# EAGLE design TC board (EAGLE 6.3)
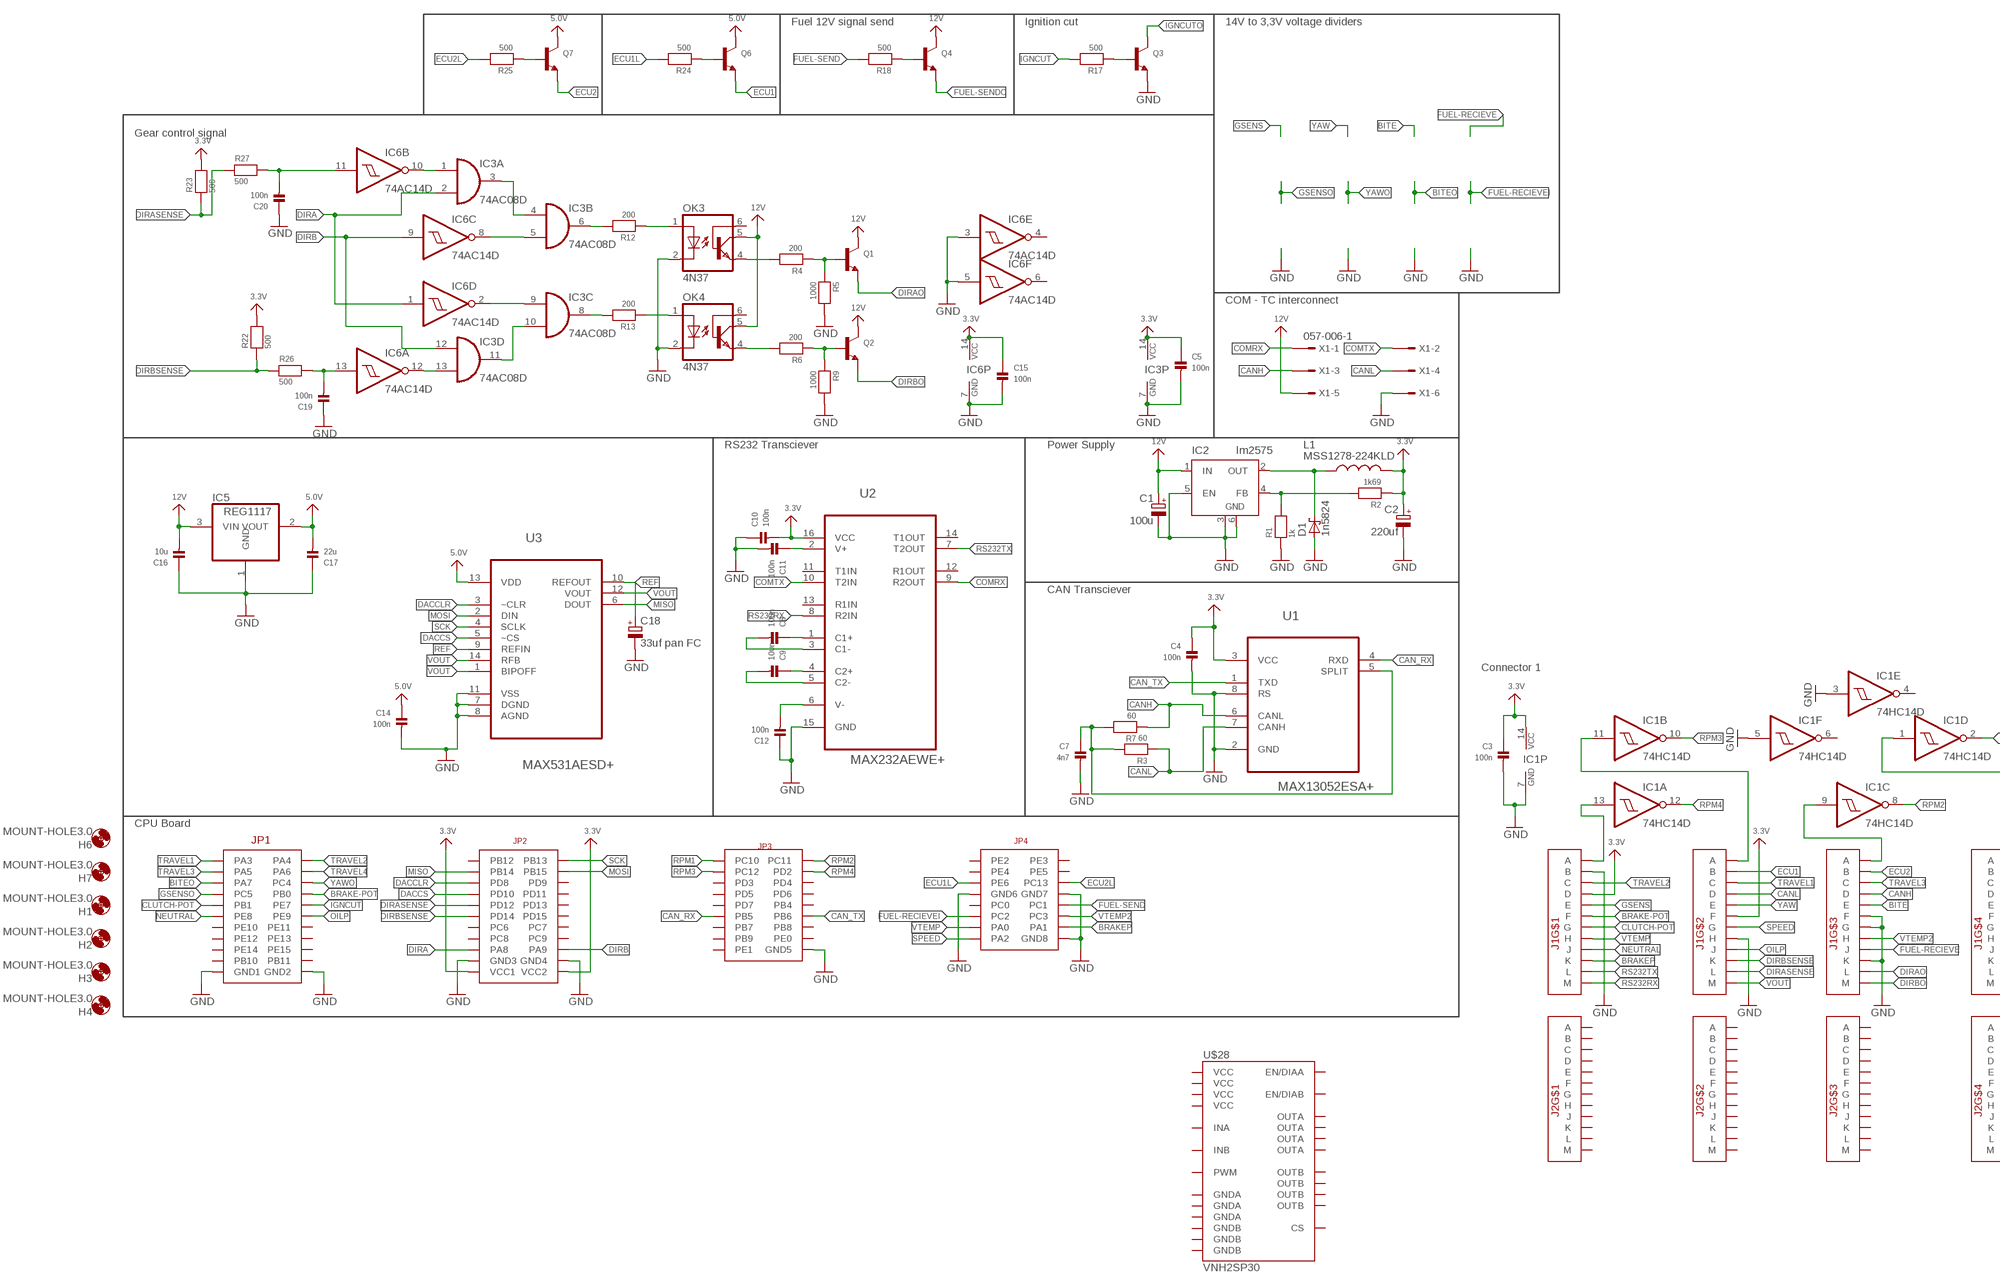
[diagram p0: schematic, sheet 1, part 1 of 2]
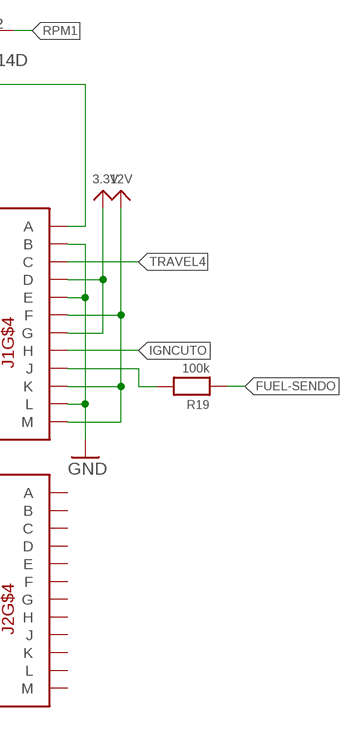
[diagram p1: schematic, sheet 1, part 2 of 2]

## Parts
C1  100u  CPOL-EUE2.5-7  [E2,5-7]
C2  220uf  CPOL-EUE3.5-8  [E3,5-8]
C3  100n  CAP_CERAMIC_0603  [_0603]
C4  100n  CAP_CERAMIC_0603  [_0603]
C5  100n  CAP_CERAMIC_0603  [_0603]
C7  4n7  CAP_CERAMIC_0603  [_0603]
C8  100n  CAP_CERAMIC_0603  [_0603]
C9  100n  CAP_CERAMIC_0603  [_0603]
C10  100n  CAP_CERAMIC_0603  [_0603]
C11  100n  CAP_CERAMIC_0603  [_0603]
C12  100n  CAP_CERAMIC_0603  [_0603]
C14  100n  CAP_CERAMIC_0603  [_0603]
C15  100n  CAP_CERAMIC_0603  [_0603]
C16  10u  CAP_CERAMIC_0805  [_0805]
C17  22u  CAP_CERAMIC_0805  [_0805]
C18  33uf pan FC  CPOL-EUUD-5X5,8  [UD-5X5,8_NICHICON]
C19  100n  CAP_CERAMIC_0805  [_0805]
C20  100n  CAP_CERAMIC_0805  [_0805]
D1  1n5824  SCHOTTKY-DIODEF126Z12  [F126Z12]
H1  MOUNT-HOLE3.0  [3,0]
H2  MOUNT-HOLE3.0  [3,0]
H3  MOUNT-HOLE3.0  [3,0]
H4  MOUNT-HOLE3.0  [3,0]
H6  MOUNT-HOLE3.0  [3,0]
H7  MOUNT-HOLE3.0  [3,0]
IC1  74HC14D  [SO14]
IC2  lm2575  LM2596S  [TO263-5]
IC3  74AC08D  [SO14]
IC5  REG1117  [SOT223]
IC6  74AC14D  [SO14]
J1  CON1  AUTOCONNECTOR  [AUTOCONNECTOR]
J2  CON1  AUTOCONNECTOR  [AUTOCONNECTOR]
L1  MSS1278-224KLD  INDUCTORPWR  [CDRH125]
OK3  4N37  [DIL06]
OK4  4N37  [DIL06]
Q1  TRANSISTOR_NPNWIDE  [SOT23-WIDE]
Q2  TRANSISTOR_NPNWIDE  [SOT23-WIDE]
Q3  TRANSISTOR_NPNWIDE  [SOT23-WIDE]
Q4  TRANSISTOR_NPNWIDE  [SOT23-WIDE]
Q6  TRANSISTOR_NPNWIDE  [SOT23-WIDE]
Q7  TRANSISTOR_NPNWIDE  [SOT23-WIDE]
R1  1k  RESISTOR_0603  [_0603]
R2  1k69  RESISTOR_0603  [_0603]
R3  60  RESISTOR_0603  [_0603]
R4  200  RESISTOR_0603  [_0603]
R5  1000  RESISTOR_0603  [_0603]
R6  200  RESISTOR_0603  [_0603]
R7  60  RESISTOR_0603  [_0603]
R9  1000  RESISTOR_0603  [_0603]
R12  200  RESISTOR_0603  [_0603]
R13  200  RESISTOR_0603  [_0603]
R17  500  RESISTOR_0603  [_0603]
R18  500  RESISTOR_0603  [_0603]
R19  100k  RESISTOR_0603  [_0603]
R22  500  RESISTOR_0603  [_0603]
R23  500  RESISTOR_0603  [_0603]
R24  500  RESISTOR_0603  [_0603]
R25  500  RESISTOR_0603  [_0603]
R26  500  RESISTOR_0603  [_0603]
R27  500  RESISTOR_0603  [_0603]
U1  MAX13052ESA+  [SOIC127P600X175-8N]
U2  MAX232AEWE+  [SOIC127P1032X265-16N]
U3  MAX531AESD+  [SOIC127P600X175-14N]
U$1  CPU-BOARD  [CPU-BOARD-JP1]
U$28  VNH2SP30  [VNH2SP30]
X1  057-006-1  [057-006-1]

## Nets
3.3V: C2.+ C3.1 C4.1 C5.1 C10.2 C15.1 IC1.14(P:VCC) IC3.14(P:VCC) IC6.14(P:VCC) J1.D1(D) J1.D4(D) J1.F2(F) J1.G4(G) L1.2 R2.1 R22.2 R23.2 U1.3(VCC) U2.16(VCC) U$1.P$43(VCC1) U$1.P$44(VCC2)
5.0V: C14.1 C17.2 IC5.2(VOUT) Q6.3(C) Q7.3(C) U3.13(VDD)
12V: C1.+ C16.2 IC2.1(IN) IC5.3(VIN) J1.F4(F) J1.K4(K) J1.M4(M) OK3.5(COL) OK4.5(COL) Q1.3(C) Q2.3(C) Q4.3(C) X1.5
BITE: J1.E3(E)
BITEO: U$1.P$5(PA7)
BRAKE-POT: J1.F1(F) U$1.P$8(PB0)
BRAKEP: J1.K1(K) U$1.P$76(PA1)
CAN_RX: U1.4(RXD) U$1.P$55(PB5)
CAN_TX: U1.1(TXD) U$1.P$56(PB6)
CANH: J1.D3(D) R7.1 U1.6(CANL) X1.3
CANL: J1.D2(D) R3.1 U1.7(CANH) X1.4
CLUTCH-POT: J1.G1(G) U$1.P$9(PB1)
COMRX: U2.9(R2OUT) X1.1
COMTX: U2.10(T2IN) X1.2
DACCLR: U3.3(~CLR) U$1.P$27(PD8)
DACCS: U3.5(~CS) U$1.P$29(PD10)
DIRA: IC3.2(A:I1) IC6.1(D:I) U$1.P$39(PA8)
DIRAO: J1.L3(L) Q1.2(E)
DIRASENSE: J1.L2(L) R23.1 R27.1 U$1.P$31(PD12)
DIRB: IC3.12(D:I0) IC6.9(C:I) U$1.P$40(PA9)
DIRBO: J1.M3(M) Q2.2(E)
DIRBSENSE: J1.K2(K) R22.1 R26.1 U$1.P$33(PD14)
ECU1: J1.B2(B) Q6.2(E)
ECU1L: R24.2 U$1.P$67(PE6)
ECU2: J1.B3(B) Q7.2(E)
ECU2L: R25.2 U$1.P$68(PC13)
FUEL-RECIEVE: J1.J3(J)
FUEL-RECIEVEI: U$1.P$73(PC2)
FUEL-SEND: R18.2 U$1.P$72(PC1)
FUEL-SENDO: Q4.2(E) R19.1
GND: C1.- C2.- C3.2 C4.2 C5.2 C7.2 C10.1 C11.2 C12.1 C14.2 C15.2 C16.1 C17.1 C18.- C19.1 C20.1 D1.A IC1.3(E:I) IC1.5(F:I) IC1.7(P:GND) IC2.3(GND) IC2.5(EN) IC2.6(GND) IC3.7(P:GND) IC5.1(GND) IC6.3(E:I) IC6.5(F:I) IC6.7(P:GND) J1.B1(B) J1.B4(B) J1.E4(E) J1.F3(F) J1.G3(G) J1.H2(H) J1.K3(K) J1.L4(L) OK3.2(C) OK4.2(C) Q3.2(E) R1.1 R5.2 R9.2 U1.2(GND) U1.8(RS) U2.15(GND) U3.7(DGND) U3.8(AGND) U3.11(VSS) U$1.P$19(GND1) U$1.P$20(GND2) U$1.P$41(GND3) U$1.P$42(GND4) U$1.P$62(GND5) U$1.P$69(GND6) U$1.P$70(GND7) U$1.P$78(GND8) X1.6
GSENS: J1.E1(E)
GSENSO: U$1.P$7(PC5)
IGNCUT: R17.2 U$1.P$10(PE7)
IGNCUTO: J1.H4(H) Q3.3(C)
MISO: U3.6(DOUT) U$1.P$25(PB14)
MOSI: U3.2(DIN) U$1.P$26(PB15)
N$1: IC2.4(FB) R1.2 R2.2
N$2: D1.C IC2.2(OUT) L1.1
N$3: IC1.9(C:I) J1.A3(A)
N$4: IC1.13(A:I) J1.A1(A)
N$5: IC1.1(D:I) J1.A4(A)
N$6: IC1.11(B:I) J1.A2(A)
N$7: OK3.4(EMI) R4.2
N$8: Q1.1(B) R4.1 R5.1
N$9: OK4.4(EMI) R6.2
N$10: Q2.1(B) R6.1 R9.1
N$11: IC3.8(C:O) R13.2
N$12: C7.1 R3.2 R7.2 U1.5(SPLIT)
N$13: C12.2 U2.6(V-)
N$14: C9.1 U2.4(C2+)
N$15: IC3.9(C:I0) IC6.2(D:O)
N$16: IC3.5(B:I1) IC6.8(C:O)
N$17: OK4.1(A) R13.1
N$18: OK3.1(A) R12.1
N$19: IC3.6(B:O) R12.2
N$20: C9.2 U2.5(C2-)
N$21: C8.2 U2.3(C1-)
N$22: C8.1 U2.1(C1+)
N$23: C11.1 U2.2(V+)
N$24: Q3.1(B) R17.1
N$25: J1.J4(J) R19.2
N$26: Q4.1(B) R18.1
N$29: IC3.3(A:O) IC3.4(B:I0)
N$30: IC3.10(C:I1) IC3.11(D:O)
N$31: IC3.13(D:I1) IC6.12(A:O)
N$32: IC3.1(A:I0) IC6.10(B:O)
N$33: C20.2 IC6.11(B:I) R27.2
N$34: Q6.1(B) R24.1
N$35: Q7.1(B) R25.1
N$36: C19.2 IC6.13(A:I) R26.2
NEUTRAL: J1.J1(J) U$1.P$11(PE8)
OILP: J1.J2(J) U$1.P$12(PE9)
REF: C18.+ U3.9(REFIN) U3.10(REFOUT)
RPM1: IC1.2(D:O) U$1.P$45(PC10)
RPM2: IC1.8(C:O) U$1.P$46(PC11)
RPM3: IC1.10(B:O) U$1.P$47(PC12)
RPM4: IC1.12(A:O) U$1.P$48(PD2)
RS232RX: J1.M1(M) U2.8(R2IN)
RS232TX: J1.L1(L) U2.7(T2OUT)
SCK: U3.4(SCLK) U$1.P$24(PB13)
SPEED: J1.G2(G) U$1.P$77(PA2)
TRAVEL1: J1.C2(C) U$1.P$1(PA3)
TRAVEL2: J1.C1(C) U$1.P$2(PA4)
TRAVEL3: J1.C3(C) U$1.P$3(PA5)
TRAVEL4: J1.C4(C) U$1.P$4(PA6)
VOUT: J1.M2(M) U3.1(BIPOFF) U3.12(VOUT) U3.14(RFB)
VTEMP: J1.H1(H) U$1.P$75(PA0)
VTEMP2: J1.H3(H) U$1.P$74(PC3)
YAW: J1.E2(E)
YAWO: U$1.P$6(PC4)
Unconnected: IC1.4(E:O) IC1.6(F:O) IC6.4(E:O) IC6.6(F:O) J2.A1(A) J2.A2(A) J2.A3(A) J2.A4(A) J2.B1(B) J2.B2(B) J2.B3(B) J2.B4(B) J2.C1(C) J2.C2(C) J2.C3(C) J2.C4(C) J2.D1(D) J2.D2(D) J2.D3(D) J2.D4(D) J2.E1(E) J2.E2(E) J2.E3(E) J2.E4(E) J2.F1(F) J2.F2(F) J2.F3(F) J2.F4(F) J2.G1(G) J2.G2(G) J2.G3(G) J2.G4(G) J2.H1(H) J2.H2(H) J2.H3(H) J2.H4(H) J2.J1(J) J2.J2(J) J2.J3(J) J2.J4(J) J2.K1(K) J2.K2(K) J2.K3(K) J2.K4(K) J2.L1(L) J2.L2(L) J2.L3(L) J2.L4(L) J2.M1(M) J2.M2(M) J2.M3(M) J2.M4(M) OK3.6(BAS) OK4.6(BAS) U2.11(T1IN) U2.12(R1OUT) U2.13(R1IN) U2.14(T1OUT) U$1.P$13(PE10) U$1.P$14(PE11) U$1.P$15(PE12) U$1.P$16(PE13) U$1.P$17(PE14) U$1.P$18(PE15) U$1.P$21(PB10) U$1.P$22(PB11) U$1.P$23(PB12) U$1.P$28(PD9) U$1.P$30(PD11) U$1.P$32(PD13) U$1.P$34(PD15) U$1.P$35(PC6) U$1.P$36(PC7) U$1.P$37(PC8) U$1.P$38(PC9) U$1.P$49(PD3) U$1.P$50(PD4) U$1.P$51(PD5) U$1.P$52(PD6) U$1.P$53(PD7) U$1.P$54(PB4) U$1.P$57(PB7) U$1.P$58(PB8) U$1.P$59(PB9) U$1.P$60(PE0) U$1.P$61(PE1) U$1.P$63(PE2) U$1.P$64(PE3) U$1.P$65(PE4) U$1.P$66(PE5) U$1.P$71(PC0) U$28.1(OUTA) U$28.3(VCC) U$28.5(INA) U$28.6(EN/DIAA) U$28.8(PWM) U$28.9(CS) U$28.10(EN/DIAB) U$28.11(INB) U$28.13(VCC) U$28.15(OUTB) U$28.16(OUTB) U$28.18(GNDB) U$28.19(GNDB) U$28.20(GNDB) U$28.21(OUTB) U$28.23(VCC) U$28.25(OUTA) U$28.26(GNDA) U$28.27(GNDA) U$28.28(GNDA) U$28.30(OUTA) U$28.SLUG1(VCC) U$28.SLUG2(OUTB) U$28.SLUG3(OUTA)

## Notes on the sheet
- Fuel 12V signal send | Ignition cut | 14V to 3,3V voltage dividers
- Gear control signal
- COM - TC interconnect
- RS232 Transciever | Power Supply
- CAN Transciever
- Connector 1
- CPU Board

## Library data of the parts
C1 C2 C18 = rcl:CPOL-EU: POLARIZED CAPACITOR, European symbol
C3-C5 C7-C12 C14-C17 C19 C20 = microbuilder:CAP_CERAMIC: Ceramic Capacitors 0402 - 0402 Surface Mount Capacitors 16pF 50V 5% [Digikey: 445-4899-2-ND] 18pF 50V 5% [Digikey: 490-1281-2-ND] 22pF 50V 5% [Digikey: 490-1283-2-ND] 68pF 50V 5% [Digikey: 490-1289-2-ND] 0.1uF 10V 10% [Digikey: 490-1318-2-ND] 1.0uF 6.3V 10% [Digikey: 490-1320-2-ND] 0603 - 0603 Surface Mount Capacitors 16 pF 50V 5% [Digikey: 445-5051-2-ND] 22 pF 50V [Digikey: PCC220ACVTR-ND] 33 pF 50V 5% [Digikey: 490-1415-1-ND] 56pF 50V 5% [Digikey: 490-1421-1-ND] 220pF 50V 5% [Digikey: 445-1285-1-ND] 680 pF 50V 2200 pF 50V 5% C0G [Digikey: 445-1297-1-ND] 5600 pF 100V 5% X7R [Digikey: 478-3711-1-ND] 0.1 µF 25V 10% [Digikey: PCC2277TR-ND] 0.22 µF 16V 10% X7R [Digikey: 445-1318-1-ND] 1.0 µF 25V 10% [Digikey: 445-5146-2-ND] 0603 - RF Specific 3pF 250V +/-0.1pF RF [Digikey: 712-1347-1-ND] 18 pF 250V 5% [Digikey: 478-3505-1-ND or 712-1322-1-ND] 56 pF 250V 5% C0G RF [Digikey: 490-4867-1-ND] 68 pF 250V RF [Digikey: 490-4868-1-ND] 0805 - 0805 Surface Mount Capacitors 220 pF 250V 2% RF Ceramic Capacitor [Digikey: 712-1398-1-ND] 1000 pF 50V 2% NP0 Ceramic Capacitor [Digikey: 478-3760-1-ND] 0.1 µF 25V 10% Ceramic Capacitor [Digikey: PCC1828TR-ND] 1.0 µF 16V 10% Ceramic Capacitor[Digikey: 490-1691-2-ND] 10.0 µF 10V 10% Ceramic Capacitor[Digikey: 709-1228-1-ND] 10.0 uF 16V 10% Ceramic Capacitor [Digikey: 478-5165-2-ND] 47 uF 6.3V 20% Ceramic Capacitor [Digikey: 587-1779-1-ND or 399-5506-1-ND] 1206 - 1206 Surface Mount Capacitors 47uF 10V 20% Ceramic Capacitor [Digikey: 490-5528-1-ND or 399-5508-1-ND or 445-6010-1-ND] 100uF 6.3V -20%, +80% Y5V Ceramic Capacitor (Digikey: 490-4512-1-ND, Mouser: 81-GRM31CF50J107ZE1L)
D1 = diode:SCHOTTKY-DIODE: Schottky Diode
H1-H4 H6 H7 = holes:MOUNT-HOLE: MOUNTING HOLE with drill center marker
IC1 IC6 = 74xx-eu:74*14: Hex schmitt trigger INVERTER
IC2 = linear:LM2596S: STEP-DOWN VOLTAGE REGULATOR
IC3 = 74xx-eu:74*08: Quad 2-input AND gate
IC5 = burr-brown:REG1117: 800mA and 1A Low Dropout (LDO) Positive Regulator 1.8V, 2.5V, 2.85V, 3.3V, 5V, and Adj; MPN: REG1117; OC_FARNELL: 1097566; OC_NEWARK: 14P6981
J1 J2 = unicorn_v2:AUTOCONNECTOR
L1 = SparkFun-Passives:INDUCTOR: Inductors Basic Inductor/Choke - 0603 and 1206. Footprints are not proven and vary greatly between part numbers. INDUCTOR POWER 3.3UH 4.0A SMD 0.197" L x 0.197" W x 0.177" H (5.00mm x 5.00mm x 4.50mm)
OK3 OK4 = optocoupler:4N37: OPTO COUPLER Source: http://www.fairchildsemi.com/pf/4N/4N35-M.html; MF: FAIRCHILD SEMICONDUCTOR; MPN: 4N37; OC_FARNELL: 1612456; OC_NEWARK: 72K9948
Q1-Q4 Q6 Q7 = microbuilder:TRANSISTOR_NPN: NPN Transistor Transistor (NPN) 500mA 45V - BC817 [Digikey: 568-1631-1-ND] Transistor (NPN) 500mA 45V - BC817,215 [Mouser: 771-BC817-T/R] SOT23-R - SOT23 footprint optimised for use with solder paste and reflow ovens. SOT23-W - SOT23 footprint optimised for hand-soldering (larger pads).
R1-R7 R9 R12 R13 R17-R19 R22-R27 = microbuilder:RESISTOR: Resistors 0402 - 0402 Surface Mount Package 22 Ohm 1% 1/16W [Digikey: 311-22.0LRTR-ND] 33 Ohm 5% 1/16W 1.0K 5% 1/16W 1.5K 5% 1/16W 2.0K 1% 1/16W 10.0K 1% 1/16W [Digikey: 311-10.0KLRTR-ND] 10.0K 5% 1/16W [Digikey: RMCF0402JT10K0TR-ND] 12.1K 1% 1/16W [Digikey: 311-22.0LRTR-ND] 100.0K 5% 1/16W 0603 - 0603 Surface Mount Package 0 Ohm 1/10 Watt 1% Resistor 15 Ohm 1/10 Watt 1% Resistor 33 Ohm 1/10 Watt 1% Resistor 49.9 Ohm 1/10 Watt 1% Resistor 100 Ohm 1/10 Watt 1% Resistor 150 Ohm 1/10 Watt 1% Resistor 240 Ohm 1/10 Watt 1% Resistor 390 Ohm 1/10 Watt 1% Resistor 560 Ohm 1/10 Watt 1% Resistor 680 Ohm 1/10 Watt 1% Resistor 750 Ohm 1/10 Watt 1% Resistor 1.0K Ohm 1/10 Watt 1% Resistor 1.5K Ohm 1/10 Watt 1% Resistor 2.0K Ohm 1/10 Watt 1% Resistor 2.2K Ohm 1/10 Watt 1% Resistor 3.3K Ohm 1/10 Watt 1% Resistor 4.7K Ohm 1/10 Watt 1% Resistor 10.0K Ohm 1/10 Watt 1% Resistor 12.0K Ohm 1/10 Watt 1% Resistor 12.1K Ohm 1/10 Watt 1% Resistor 20.0K Ohm 1/10 Watt 1% Resistor 33.0K Ohm 1/10 Watt 1% Resistor 100.0K Ohm 1/10 Watt 1% Resistor 0805 - 0805 Surface Mount Package 0 Ohm 1/8 Watt 1% Resistor 33 Ohm 1/8 Watt 1% Resistor 100 Ohm 1/8 Watt 1% Resistor 150 Ohm 1/8 Watt 1% Resistor 200 Ohm 1/8 Watt 1% Resistor 240 Ohm 1/8 Watt 1% Resistor 330 Ohm 1/8 Watt 1% Resistor 390 Ohm 1/8 Watt 1% Resistor 470 Ohm 1/8 Watt 1% Resistor 1.0K Ohm 1/8 Watt 1% Resistor 1.5K Ohm 1/8 Watt 1% Resistor 2.0K Ohm 1/8 Watt 1% Resistor 4.7K Ohm 1/8 Watt 1% Resistor 5.1K Ohm 1/8 Watt 1% Resistor 5.6K Ohm 1/8 Watt 1% Resistor 10.0K Ohm 1/8 Watt 1% Resistor 22.0K Ohm 1/8 Watt 1% Resistor 33.0K Ohm 1/8 Watt 1% Resistor 100K Ohm 1/8 Watt 1% Resistor 1206 - 1206 Surface Mount Package 2012 - 2010 Surface Mount Package 0.11 Ohm 1/2 Watt 1% Resistor - Digikey: RHM.11UCT-ND
U1 = Maxim_By_element14_Batch_1:MAX13052ESA+: Industry-Standard High-Speed CAN Transceivers with ±80V Fault Protection; MPN: MAX13052ESA+; OC_FARNELL: 1600112; OC_NEWARK: 99K2875; PACKAGE: SOIC-8; SUPPLIER: Maxim
U2 = Maxim_By_element14_Batch_1:MAX232AEWE+: +5V-Powered, Multichannel RS-232 Drivers/Receivers; MPN: MAX232AEWE+; OC_FARNELL: 9724400; OC_NEWARK: 67K4435; PACKAGE: SOIC-16; SUPPLIER: Maxim
U3 = Maxim_By_element14_Batch_1:MAX531AESD+: DAC; MPN: MAX531AESD+; OC_FARNELL: -; OC_NEWARK: 23K6158; PACKAGE: SOIC-14; SUPPLIER: Maxim
U$1 = unicorn_v2:CPU-BOARD
U$28 = SparkFun-PowerIC:VNH2SP30: 30A motor driver IC
X1 = con-panduit:057-006-: CONNECTOR 6-pin series 057 contact pc board low profile headers; OC_FARNELL: unknown; OC_NEWARK: unknown

## Board
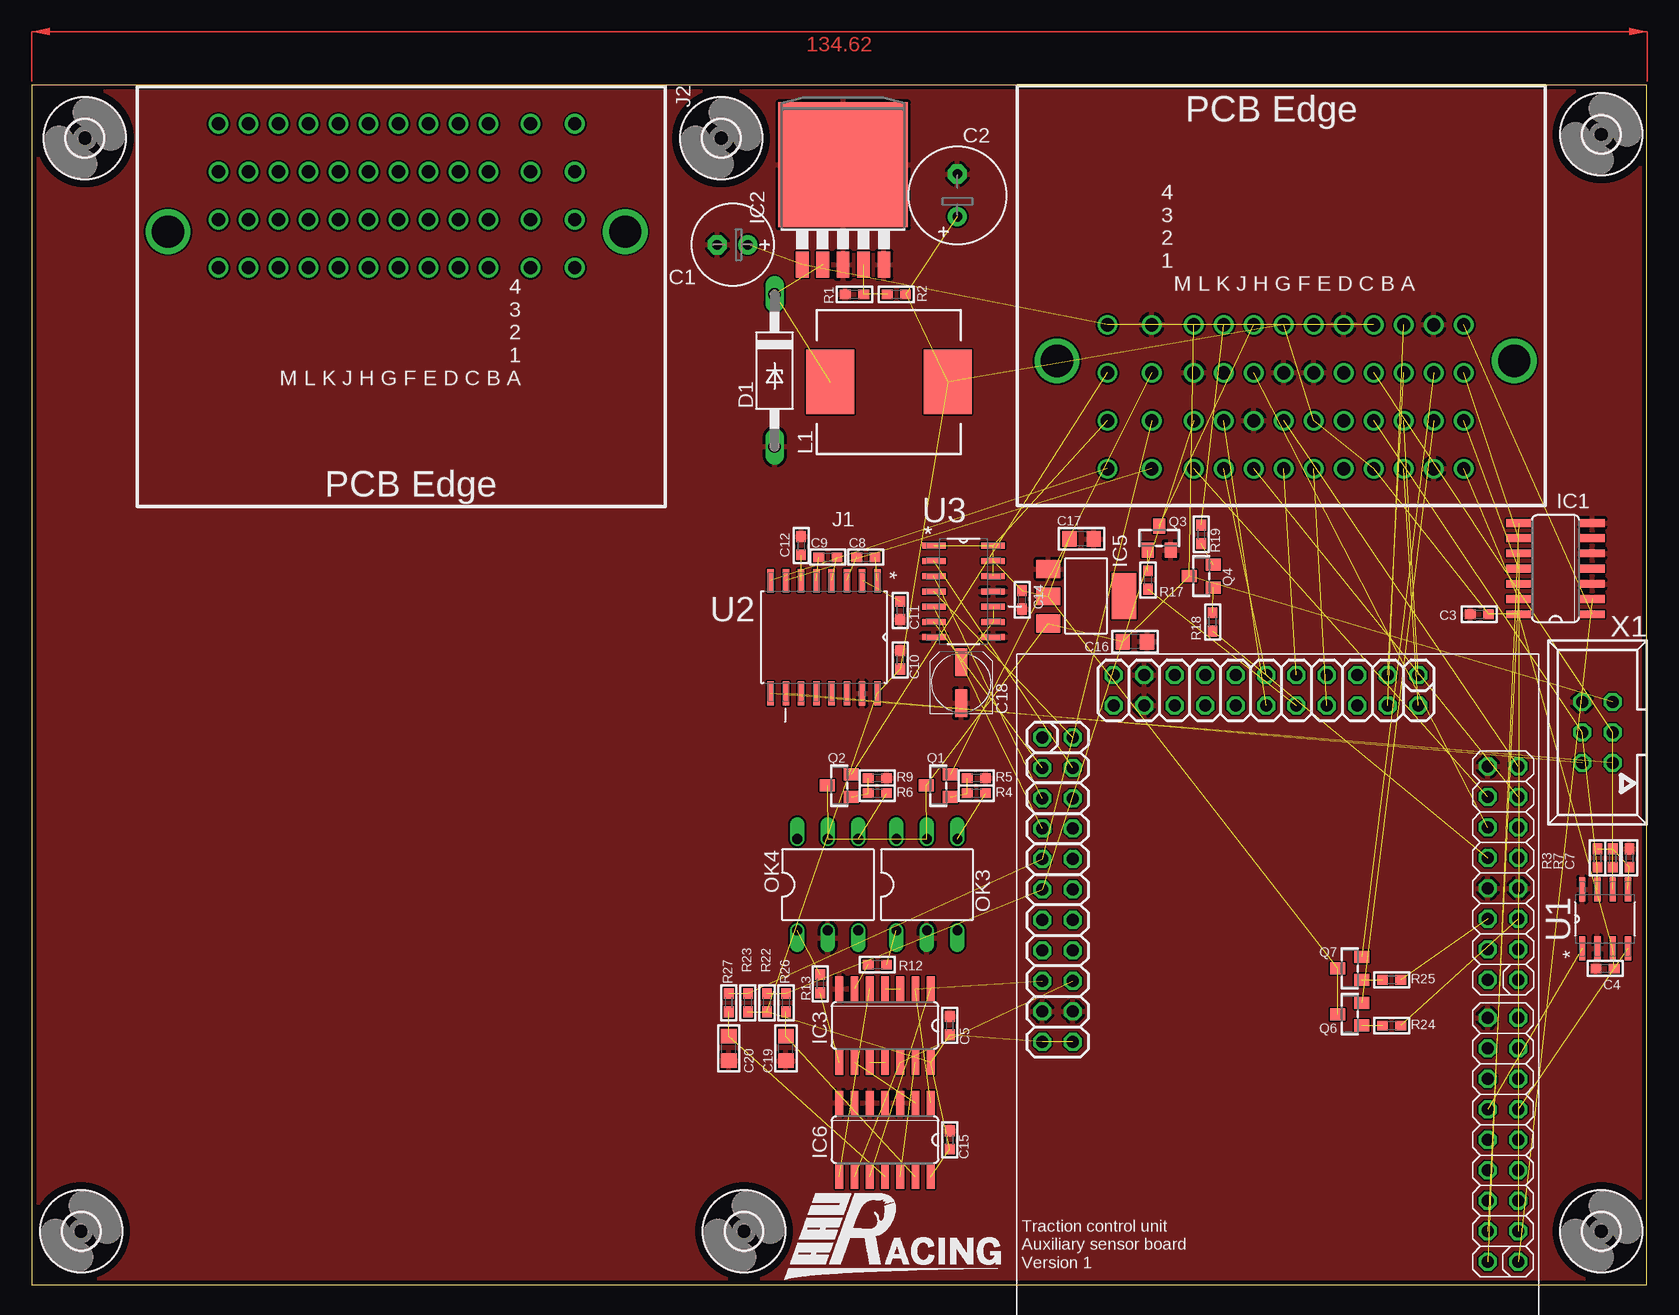
[diagram p2: board, top side]
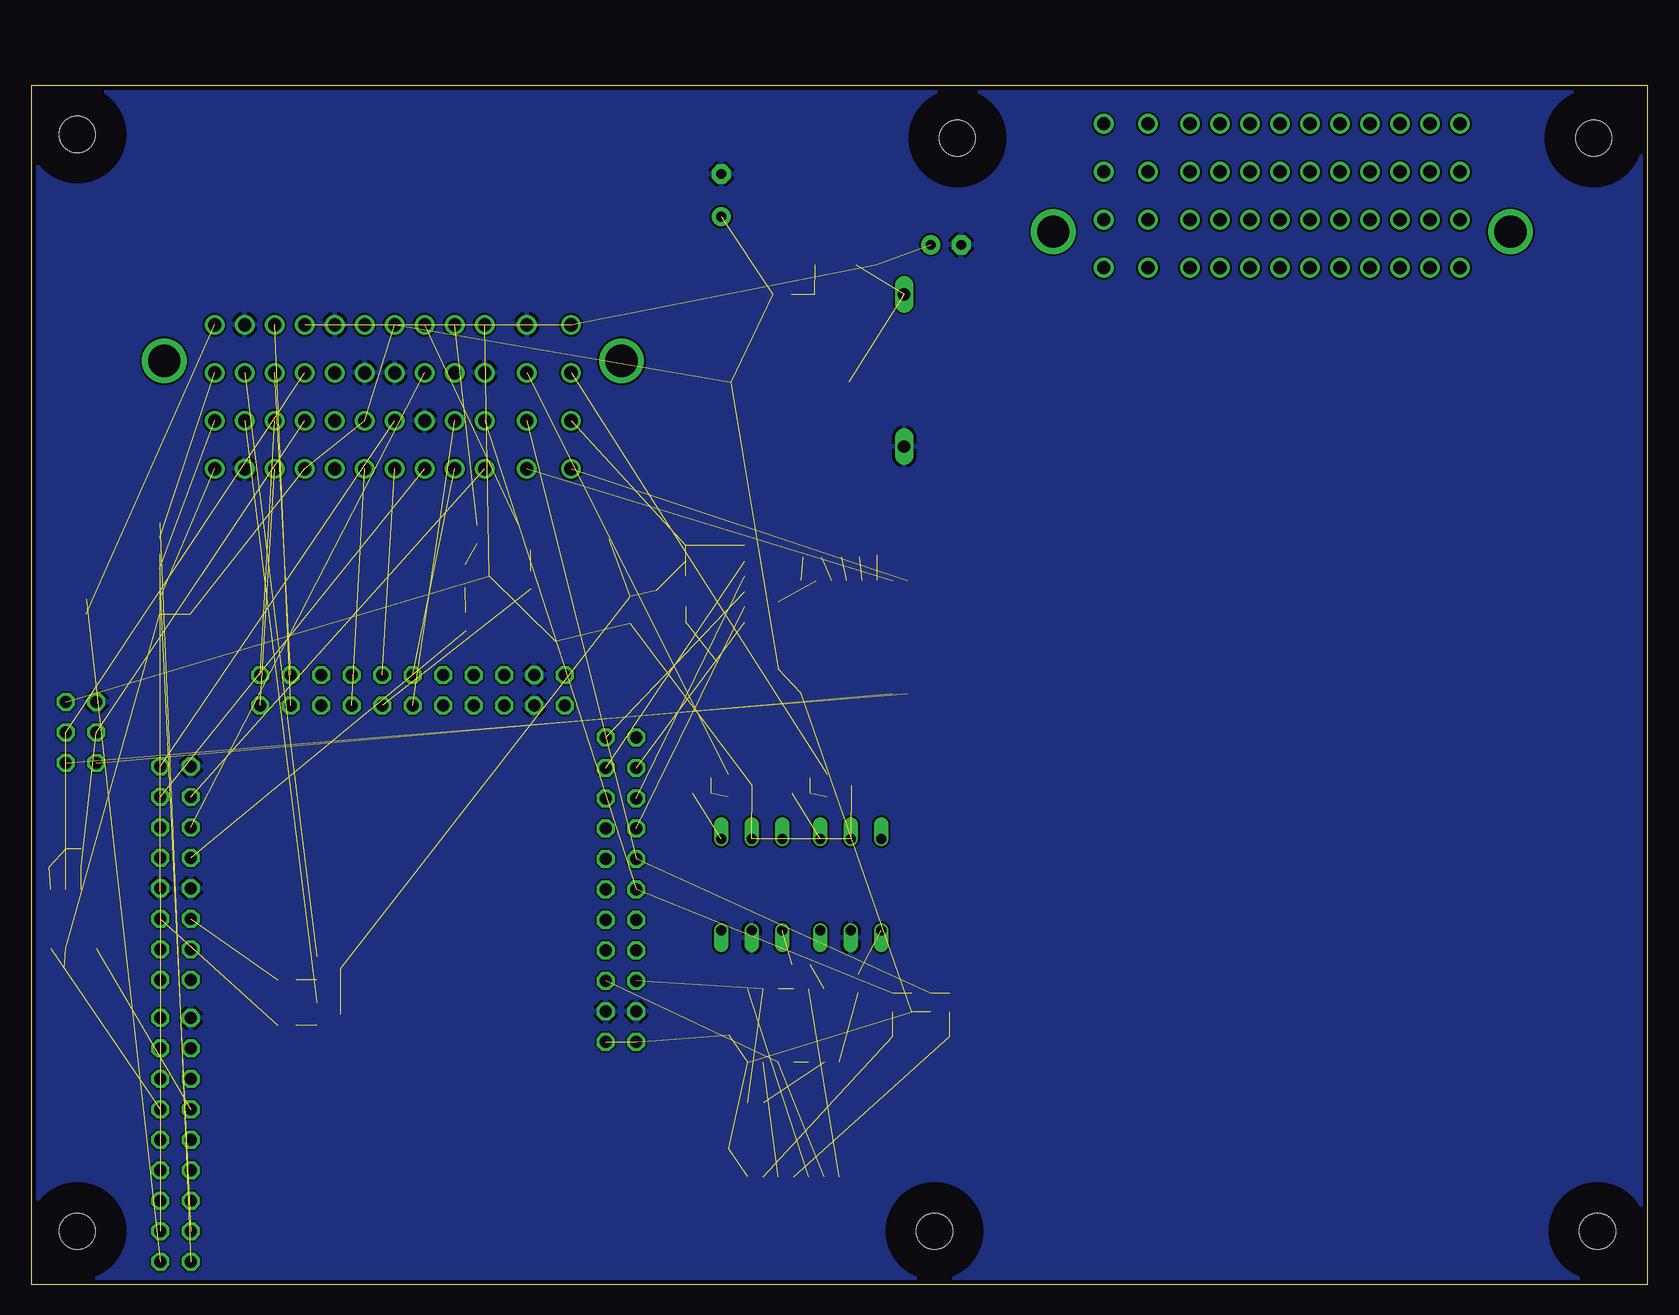
[diagram p3: board, bottom side, seen from below]

Size 134.6 x 100 mm. Coordinates in mm from the lower left corner, seen from the top.
Outline: 0,0 134.6,0 134.6,100 0,100 0,0
Copper layers (1*16): Top 0.0356mm / dielectric 1.5011mm / Bottom 0.0356mm
Design rules "LaenPCBOrder": minimum track width 6mil, minimum drill 13mil, track to track 6mil, track to pad 6mil, pad to pad 6mil, via to via 6mil, smd to smd 6mil, copper to edge 15mil, drill to drill 6mil, minimum pad ring 7mil, minimum via ring 7mil, stop-mask expansion 3mil, vias tented up to drill 0mil, thermal gap 10mil

### Footprints (pad centres in the part's own frame; a part is rotated, then mirrored left to right if it is on the bottom)
E2,5-7 = drill 0.813 pad 1.6: + -1.27,0 | drill 0.813 pad 1.6 octagon: - 1.27,0
E3,5-8 = drill 0.813 pad 1.6: + -1.778,0 | drill 0.813 pad 1.6 octagon: - 1.778,0
_0603 = smd 0.9 x 0.8: 1 -0.762,0; 2 0.762,0
_0805 = smd 1.2 x 1.3: 1 -1.016,0; 2 1.016,0
UD-5X5,8_NICHICON = smd 2.3 x 1: + 1.725,0; - -1.7,0
F126Z12 = drill 1.016 long: A 6.35,0; C -6.35,0
3,0 = hole 3: 0,0
SO14 = smd 0.66 x 2.032: 1 -3.81,-3.073; 2 -2.54,-3.073; 3 -1.27,-3.073; 4 0,-3.073; 5 1.27,-3.073; 6 2.54,-3.073; 7 3.81,-3.073; 8 3.81,3.073; 9 2.54,3.073; 10 1.27,3.073; 11 0,3.073; 12 -1.27,3.073; 13 -2.54,3.073; 14 -3.81,3.073
TO263-5 = smd 1.067 x 2.159: 1 -3.404,-5.791; 2 -1.702,-5.791; 3 0,-5.791; 4 1.702,-5.791; 5 3.404,-5.791 | smd 10.8 x 10.41: 6 0,2.54
SOT223 = smd 1.499 x 2.007: 1 -2.261,-3.15; 2 0.025,-3.15; 3 2.311,-3.15 | smd 3.81 x 2.007: 4 0,3.15
AUTOCONNECTOR = drill 1.1: A1 15.22,-6.92; A2 15.22,-2.92; A3 15.22,1.08; A4 15.22,5.08; B1 12.72,-6.92; B2 12.72,-2.92; B3 12.72,1.08; B4 12.72,5.08; C1 10.22,-6.92; C2 10.22,-2.92; C3 10.22,1.08; C4 10.22,5.08; D1 7.72,-6.92; D2 7.72,-2.92; D3 7.72,1.08; D4 7.72,5.08; E1 5.22,-6.92; E2 5.22,-2.92; E3 5.22,1.08; E4 5.22,5.08; F1 2.72,-6.92; F2 2.72,-2.92; F3 2.72,1.08; F4 2.72,5.08; G1 0.22,-6.92; G2 0.22,-2.92; G3 0.22,1.08; G4 0.22,5.08; H1 -2.28,-6.92; H2 -2.28,-2.92; H3 -2.28,1.08; H4 -2.28,5.08; J1 -4.78,-6.92; J2 -4.78,-2.92; J3 -4.78,1.08; J4 -4.78,5.08; K1 -7.28,-6.92; K2 -7.28,-2.92; K3 -7.28,1.08; K4 -7.28,5.08; L1 -10.78,-6.92; L2 -10.78,-2.92; L3 -10.78,1.08; L4 -10.78,5.08; M1 -14.48,-6.92; M2 -14.48,-2.92; M3 -14.48,1.08; M4 -14.48,5.08 | drill 2.7: SHIELD1 19.42,2.08; SHIELD2 -18.68,2.08
CDRH125 = smd 5.4 x 4: 1 0,4.9; 2 0,-4.9
DIL06 = drill 0.813 offset: 1 -2.54,-3.81; 2 0,-3.81; 3 2.54,-3.81; 4 2.54,3.81; 5 0,3.81; 6 -2.54,3.81
SOT23-WIDE = smd 1 x 1.27: 1 -0.95,-1; 2 0.95,-1; 3 0,1
SOIC127P600X175-8N = smd 1.981 x 0.533: 1 -2.464,1.905; 2 -2.464,0.635; 3 -2.464,-0.635; 4 -2.464,-1.905; 5 2.464,-1.905; 6 2.464,-0.635; 7 2.464,0.635; 8 2.464,1.905
SOIC127P1032X265-16N = smd 1.981 x 0.533: 1 -4.699,4.445; 2 -4.699,3.175; 3 -4.699,1.905; 4 -4.699,0.635; 5 -4.699,-0.635; 6 -4.699,-1.905; 7 -4.699,-3.175; 8 -4.699,-4.445; 9 4.699,-4.445; 10 4.699,-3.175; 11 4.699,-1.905; 12 4.699,-0.635; 13 4.699,0.635; 14 4.699,1.905; 15 4.699,3.175; 16 4.699,4.445
SOIC127P600X175-14N = smd 1.981 x 0.508: 1 -2.464,3.81; 2 -2.464,2.54; 3 -2.464,1.27; 4 -2.464,0; 5 -2.464,-1.27; 6 -2.464,-2.54; 7 -2.464,-3.81; 8 2.464,-3.81; 9 2.464,-2.54; 10 2.464,-1.27; 11 2.464,0; 12 2.464,1.27; 13 2.464,2.54; 14 2.464,3.81
CPU-BOARD-JP1 = drill 1 octagon: P$1 1.27,-12.7; P$2 -1.27,-12.7; P$3 1.27,-10.16; P$4 -1.27,-10.16; P$5 1.27,-7.62; P$6 -1.27,-7.62; P$7 1.27,-5.08; P$8 -1.27,-5.08; P$9 1.27,-2.54; P$10 -1.27,-2.54; P$11 1.27,0; P$12 -1.27,0; P$13 1.27,2.54; P$14 -1.27,2.54; P$15 1.27,5.08; P$16 -1.27,5.08; P$17 1.27,7.62; P$18 -1.27,7.62; P$19 1.27,10.16; P$20 -1.27,10.16; P$21 1.27,12.7; P$22 -1.27,12.7; P$23 -3.905,18.637; P$24 -3.905,16.097; P$25 -6.445,18.637; P$26 -6.445,16.097; P$27 -8.985,18.637; P$28 -8.985,16.097; P$29 -11.525,18.637; P$30 -11.525,16.097; P$31 -14.065,18.637; P$32 -14.065,16.097; P$33 -16.605,18.637; P$34 -16.605,16.097; P$35 -19.145,18.637; P$36 -19.145,16.097; P$37 -21.685,18.637; P$38 -21.685,16.097; P$39 -24.225,18.637; P$40 -24.225,16.097; P$41 -26.765,18.637; P$42 -26.765,16.097; P$43 -29.305,18.637; P$44 -29.305,16.097; P$45 -47.625,-21.018; P$46 -47.625,-18.479; P$47 -45.085,-21.018; P$48 -45.085,-18.479; P$49 -42.545,-21.018; P$50 -42.545,-18.479; P$51 -40.005,-21.018; P$52 -40.005,-18.479; P$53 -37.465,-21.018; P$54 -37.465,-18.479; P$55 -34.925,-21.018; P$56 -34.925,-18.479; P$57 -32.385,-21.018; P$58 -32.385,-18.479; P$59 -29.845,-21.018; P$60 -29.845,-18.479; P$61 -27.305,-21.018; P$62 -27.305,-18.479; P$63 -24.115,-21.024; P$64 -24.115,-18.484; P$65 -21.575,-21.024; P$66 -21.575,-18.484; P$67 -19.035,-21.024; P$68 -19.035,-18.484; P$69 -16.495,-21.024; P$70 -16.495,-18.484; P$71 -13.955,-21.024; P$72 -13.955,-18.484; P$73 -11.415,-21.024; P$74 -11.415,-18.484; P$75 -8.875,-21.024; P$76 -8.875,-18.484; P$77 -6.335,-21.024; P$78 -6.335,-18.484
VNH2SP30 = smd 0.67 x 1.3: 1 -7,-9.1; 2 -6,-9.1; 3 -5,-9.1; 4 -4,-9.1; 5 -3,-9.1; 6 -2,-9.1; 7 -1,-9.1; 8 0,-9.1; 9 1,-9.1; 10 2,-9.1; 11 3,-9.1; 12 4,-9.1; 13 5,-9.1; 14 6,-9.1; 15 7,-9.1; 16 7,9.1; 17 6,9.1; 18 5,9.1; 19 4,9.1; 20 3,9.1; 21 2,9.1; 22 1,9.1; 23 0,9.1; 24 -1,9.1; 25 -2,9.1; 26 -3,9.1; 27 -4,9.1; 28 -5,9.1; 29 -6,9.1; 30 -7,9.1 | smd 10.3 x 5.25: SLUG1 0,-3.05 | smd 6.23 x 5.25: SLUG2 4.165,3.05; SLUG3 -4.165,3.05
057-006-1 = drill 1 octagon: 1 -2.54,-1.27; 2 -2.54,1.27; 3 0,-1.27; 4 0,1.27; 5 2.54,-1.27; 6 2.54,1.27

### Placement (x,y rotation side)
C1  58.42,86.68 180 top
C2  77.15,90.81 90 top
C3  120.65,55.88 180 top
C4  131.13,26.35 180 top
C5  76.52,21.59 90 top
C7  133.16,35.56 90 top
C8  69.53,60.64 180 top
C9  66.36,60.64 180 top
C10  72.39,52.07 270 top
C11  72.39,56.2 270 top
C12  64.13,61.59 270 top
C14  82.55,57.09 270 top
C15  76.52,12.07 90 top
C16  91.95,53.59 180 top
C17  87.5,62.17 180 top
C18  77.47,50.17 90 top
C19  62.87,19.68 90 top
C20  58.1,19.68 90 top
D1  61.91,76.2 270 top
H1  130.81,95.89 0 top
H2  57.47,95.57 0 top
H3  59.37,4.45 0 top
H4  130.81,4.45 0 top
H5  MOUNT-HOLE3.0  [3,0]  4.13,4.45 0 top
H6  -18.1,-4.44 0 top  (outside the outline)
H7  4.44,95.57 0 top
IC1  127,59.69 90 top
IC2  67.63,90.81 0 top
IC3  71.12,21.59 180 top
IC5  87.88,57.4 270 top
IC6  71.12,12.07 180 top
J1  104.14,74.93 0 top
J2  30.8,89.85 180 top
L1  71.44,75.25 90 top
OK3  74.61,33.34 0 top
OK4  66.36,33.34 0 top
Q1  75.56,41.59 90 top
Q2  67.31,41.59 90 top
Q3  93.98,62.23 0 top
Q4  97.47,59.06 90 top
Q6  109.85,22.54 90 top
Q7  109.85,26.35 90 top
R1  68.58,82.55 0 top
R2  72.07,82.55 180 top
R3  130.49,35.56 90 top
R4  78.74,40.96 0 top
R5  78.74,42.23 0 top
R6  70.48,40.96 0 top
R7  131.76,35.56 90 top
R9  70.48,42.23 0 top
R12  70.48,26.67 180 top
R13  65.72,25.08 270 top
R17  93.03,58.74 270 top
R18  98.43,55.25 270 top
R19  97.47,62.55 90 top
R22  61.28,23.5 270 top
R23  59.69,23.5 270 top
R24  113.35,21.59 0 top
R25  113.35,25.4 0 top
R26  62.87,23.5 270 top
R27  58.1,23.5 270 top
U1  131.13,30.48 90 top
U2  66.04,53.98 270 top
U3  77.66,57.79 0 top
U$1  102.87,49.53 90 top
U$28  -31.12,2.86 0 top  (outside the outline)
X1  130.49,46.04 90 top

### Tracks (layer width: path | path; a pad name or v marks a point on that pad's centre or on a via)
3.3V  (20 unrouted)
5.0V  (5 unrouted)
12V  (12 unrouted)
BRAKE-POT  (1 unrouted)
BRAKEP  (1 unrouted)
CAN_RX  (1 unrouted)
CAN_TX  (1 unrouted)
CANH  (3 unrouted)
CANL  (3 unrouted)
CLUTCH-POT  (1 unrouted)
COMRX  (1 unrouted)
COMTX  (1 unrouted)
DACCLR  (1 unrouted)
DACCS  (1 unrouted)
DIRA  (2 unrouted)
DIRAO  (1 unrouted)
DIRASENSE  (3 unrouted)
DIRB  (2 unrouted)
DIRBO  (1 unrouted)
DIRBSENSE  (3 unrouted)
ECU1  (1 unrouted)
ECU1L  (1 unrouted)
ECU2  (1 unrouted)
ECU2L  (1 unrouted)
FUEL-SEND  (1 unrouted)
FUEL-SENDO  (1 unrouted)
GND
  pour Bottom: 0,0 134.62,0 134.62,100.33 0,100.33
  pour Top: 0,0 134.62,0 134.62,100.33 0,100.33
IGNCUT  (1 unrouted)
IGNCUTO  (1 unrouted)
MISO  (1 unrouted)
MOSI  (1 unrouted)
N$1  (2 unrouted)
N$2  (2 unrouted)
N$3  (1 unrouted)
N$4  (1 unrouted)
N$5  (1 unrouted)
N$6  (1 unrouted)
N$7  (1 unrouted)
N$8  (2 unrouted)
N$9  (1 unrouted)
N$10  (2 unrouted)
N$11  (1 unrouted)
N$12  (3 unrouted)
N$13  (1 unrouted)
N$14  (1 unrouted)
N$15  (1 unrouted)
N$16  (1 unrouted)
N$17  (1 unrouted)
N$18  (1 unrouted)
N$19  (1 unrouted)
N$20  (1 unrouted)
N$21  (1 unrouted)
N$22  (1 unrouted)
N$23  (1 unrouted)
N$24  (1 unrouted)
N$25  (1 unrouted)
N$26  (1 unrouted)
N$29  (1 unrouted)
N$30  (1 unrouted)
N$31  (1 unrouted)
N$32  (1 unrouted)
N$33  (2 unrouted)
N$34  (1 unrouted)
N$35  (1 unrouted)
N$36  (2 unrouted)
NEUTRAL  (1 unrouted)
OILP  (1 unrouted)
REF  (2 unrouted)
RPM1  (1 unrouted)
RPM2  (1 unrouted)
RPM3  (1 unrouted)
RPM4  (1 unrouted)
RS232RX  (1 unrouted)
RS232TX  (1 unrouted)
SCK  (1 unrouted)
SPEED  (1 unrouted)
TRAVEL1  (1 unrouted)
TRAVEL2  (1 unrouted)
TRAVEL3  (1 unrouted)
TRAVEL4  (1 unrouted)
VOUT  (3 unrouted)
VTEMP  (1 unrouted)
VTEMP2  (1 unrouted)
(copper drawn outside any net)
  shapes: Top area x1

### Text on the board
tSilk: Traction control unit / Auxiliary sensor board / Version 1